# Altium schematic sheet LORA.SchDoc
size A4; SheetNumber: 8; SheetTotal: 8
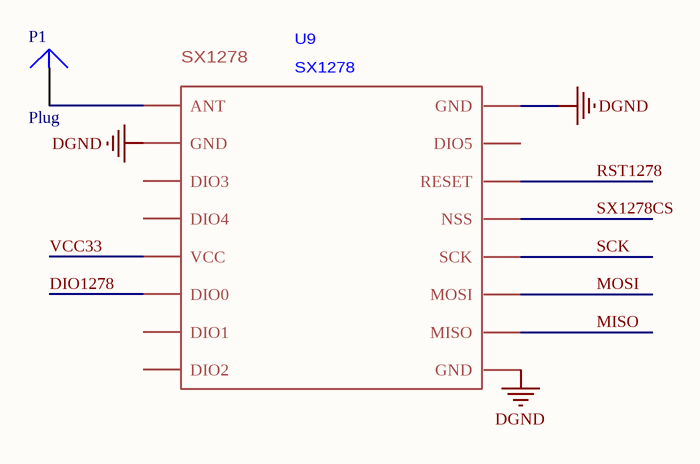
[diagram p0: LORA.SchDoc]

## Parts
P1  Plug  [PIN1]
U9  SX1278  [SX1278_2]

## Nets
DGND: U9.GND@1(GND) U9.GND@2(GND) U9.GND@3(GND)
DIO1278: U9.DIO0
MISO: U9.MISO
MOSI: U9.MOSI
RST1278: U9.RESET
SCK: U9.SCK
SX1278CS: U9.NSS
VCC33: U9.VCC
NetP1_1: P1.1 U9.ANT

Not connected (* = marked no-connect by the designer): U9 DIO1 DIO2 DIO3 DIO4 DIO5

## Library data of the parts
U9 = SX1278_2: lora模块
P1 = Plug: LatestRevisionDate: 17-Jul-2002; LatestRevisionNote: Re-released for DXP Platform.; Publisher: Altium Limited